# Altium project pca10201.PrjPCB (part 1 of 4)
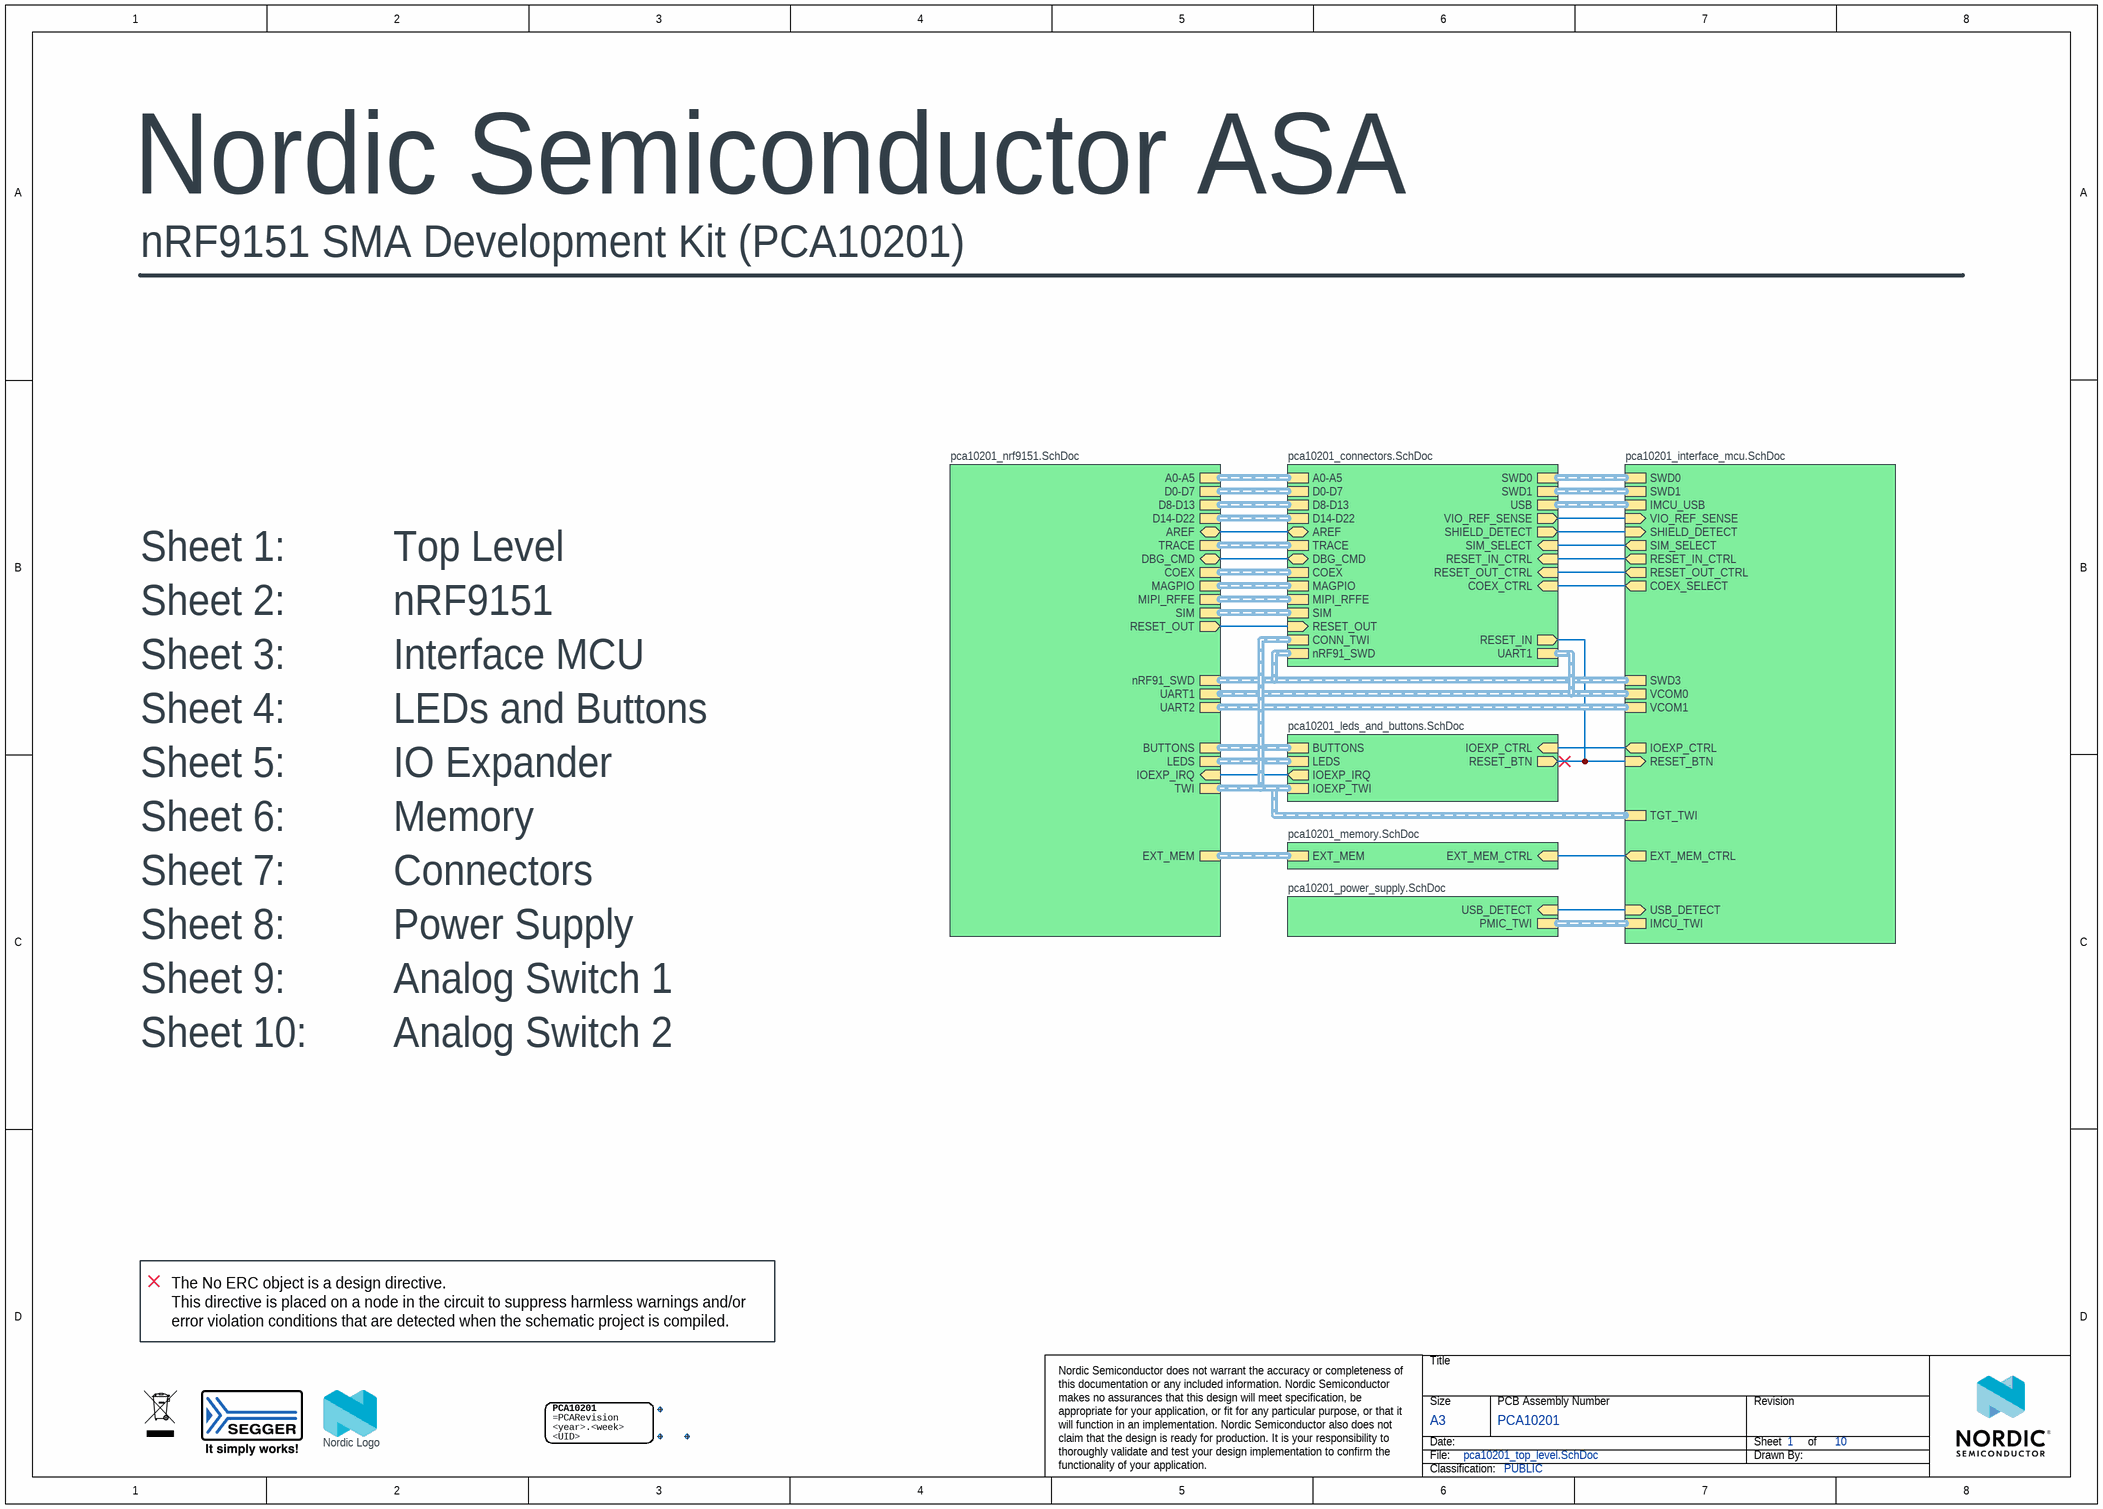
[diagram p0: pca10201_top_level.SchDoc]
SurfaceFinish: ENIG Gold; SoldermaskColor: Blue; SilkscreenColor: White; ProjectName: nRF9151-DK; ProductName: nRF9151-SMA-DK; PCBStackup: 4001; PCBRevision: 0478RUBR; PCBNumber: 400926; PCARevision: 1.0.0; PCAName: PCA10201; Organization: Nordic Semiconductor; NrOfLayers: 4; Dielectric: FR-4; Designer: RUBR; Compliance: RoHS, REACH, Halogen-Free; Classification: PUBLIC; BoardTitle: nRF9151 SMA Development Kit; BoardThickness: 1.6mm
10 sheets, 311 parts. Net scope: hierarchical (ports join the sheet entries above them; power ports are global).
Board file: 400926.PcbDoc
Sheets:
  pca10201_top_level.SchDoc
     = pca10201_nrf9151.SchDoc
     = pca10201_interface_mcu.SchDoc
      S1 = pca10201_switch_fsa.SchDoc
      S2 = pca10201_switch_fsa.SchDoc
      S3 = pca10201_switch_fsa.SchDoc
      S4 = pca10201_switch_fsa.SchDoc
     = pca10201_leds_and_buttons.SchDoc
      S5 = pca10201_switch_fsa.SchDoc
      S6 = pca10201_switch_fsa.SchDoc
      S7 = pca10201_switch_nx.SchDoc
      Designator = pca10201_io_expander.SchDoc
     = pca10201_memory.SchDoc
      S8 = pca10201_switch_fsa.SchDoc
     = pca10201_connectors.SchDoc
      S9 = pca10201_switch_nx.SchDoc
      S10 = pca10201_switch_fsa.SchDoc
      S11 = pca10201_switch_fsa.SchDoc
     = pca10201_power_supply.SchDoc

## Sheet pca10201_top_level.SchDoc: =BoardTitle + ' - Top Level'
size A3; Organization: Nordic Semiconductor; DocumentNumber: 1; Revision: 1.0.0; SheetNumber: 1; SheetTotal: 10; Author: RUBR; CompanyName: Nordic Semiconductor; DrawnBy: RUBR; DocumentSize: A3; ProjectName: nRF9151-DK

### Parts
Fid1  Fiducial mark  [Fiducial]  (value not drawn)
Fid2  Fiducial mark  [Fiducial]  (value not drawn)
Fid3  Fiducial mark  [Fiducial]  (value not drawn)
LABEL1  15x40mm  [LabelSilk_15x40]  (value not drawn)
LOGO1  WEE Symbol  [WEEE_3x4.5mm]  (value not drawn)  (no BOM)
LOGO2  Segger Logo S  [SEGGER_LOGO_S]  (value not drawn)  (no BOM)
LOGO3  Nordic Logo  [NORDIC_LOGO_LYING]  (no BOM)

### Sub-sheets
? = pca10201_nrf9151.SchDoc: nRF91_SWD (harness SWD), DBG_CMD (bidir), UART1 (harness UART), COEX (harness COEX), UART2 (harness UART), SIM (harness SIM), TWI (harness TWI), A0-A5 (harness 6CH), AREF (bidir), TRACE (harness TRACE), BUTTONS (harness 4CH), LEDS (harness 4CH), IOEXP_IRQ (in), EXT_MEM (harness SPI), MIPI_RFFE (harness MIPI_RFFE), MAGPIO (harness MAGPIO), RESET_OUT (out), D8-D13 (harness 6CH), D14-D22 (harness 9CH), D0-D7 (harness 8CH)
? = pca10201_interface_mcu.SchDoc: VCOM1 (harness UART), VCOM0 (harness UART), USB_DETECT (in), RESET_BTN (in), SWD3 (harness SWD), SWD1 (harness SWD), IMCU_USB (harness USB), SWD0 (harness SWD), COEX_SELECT (out), IOEXP_CTRL (out), SIM_SELECT (out), TGT_TWI (harness TWI), VIO_REF_SENSE (in), IMCU_TWI (harness TWI), RESET_IN_CTRL (out), EXT_MEM_CTRL (out), SHIELD_DETECT (in), RESET_OUT_CTRL (out)
? = pca10201_leds_and_buttons.SchDoc: BUTTONS (harness 4CH), LEDS (harness 4CH), IOEXP_CTRL (in), IOEXP_IRQ (out), RESET_BTN (out), IOEXP_TWI (harness TWI)
? = pca10201_memory.SchDoc: EXT_MEM_CTRL (in), EXT_MEM (harness SPI)
? = pca10201_connectors.SchDoc: COEX (harness COEX), nRF91_SWD (harness SWD), DBG_CMD (bidir), MIPI_RFFE (harness MIPI_RFFE), A0-A5 (harness 6CH), TRACE (harness TRACE), USB (harness USB), SIM (harness SIM), AREF (bidir), MAGPIO (harness MAGPIO), SWD0 (harness SWD), SWD1 (harness SWD), SHIELD_DETECT (out), UART1 (harness UART), SIM_SELECT (in), VIO_REF_SENSE (out), CONN_TWI (harness TWI), RESET_IN_CTRL (in), RESET_OUT (in), RESET_OUT_CTRL (in), RESET_IN (out), D8-D13 (harness 6CH), D14-D22 (harness 9CH), D0-D7 (harness 8CH), COEX_CTRL (in)
? = pca10201_power_supply.SchDoc: USB_DETECT (in), PMIC_TWI (harness TWI)

### Nets
COEX_SELECT: sheet /COEX_SELECT, sheet /COEX_CTRL
DBG_CMD: sheet /DBG_CMD, sheet /DBG_CMD
EXT_MEM_CTRL: sheet /EXT_MEM_CTRL, sheet /EXT_MEM_CTRL
IOEXP_CTRL: sheet /IOEXP_CTRL, sheet /IOEXP_CTRL
P0.19/AIN6: sheet /IOEXP_IRQ, sheet /IOEXP_IRQ
P0.20/AIN7: sheet /AREF, sheet /AREF
P0.21: sheet /RESET_OUT, sheet /RESET_OUT
RESET_BUTTON: sheet /RESET_BTN, sheet /RESET_BTN, sheet /RESET_IN
RESET_IN_CTRL: sheet /RESET_IN_CTRL, sheet /RESET_IN_CTRL
RESET_OUT_CTRL: sheet /RESET_OUT_CTRL, sheet /RESET_OUT_CTRL
SHIELD_DETECT: sheet /SHIELD_DETECT, sheet /SHIELD_DETECT
SIM_SELECT: sheet /SIM_SELECT, sheet /SIM_SELECT
USB_DETECT: sheet /USB_DETECT, sheet /USB_DETECT
VIO_REF_SENSE: sheet /VIO_REF_SENSE, sheet /VIO_REF_SENSE

### Buses and harness runs
harness sheet /CONN_TWI = sheet /IOEXP_TWI = sheet /TGT_TWI = sheet /TWI
harness sheet /IMCU_TWI = sheet /PMIC_TWI
harness sheet /IMCU_USB = sheet /USB
harness sheet /nRF91_SWD = sheet /SWD3
harness sheet /UART1 = sheet /VCOM0
harness sheet /UART2 = sheet /VCOM1

### Notes on the sheet
- Sheet 1:          Top Level
- Sheet 2:          nRF9151
- Sheet 3:          Interface MCU
- Sheet 4:          LEDs and Buttons
- Sheet 5:          IO Expander
- Sheet 6:          Memory
- Sheet 7:          Connectors
- Sheet 8:          Power Supply
- Sheet 9:          Analog Switch 1
- Sheet 10:        Analog Switch 2
- The No ERC object is a design directive.
  This directive is placed on a node in the circuit to suppress harmless warnings and/or error violation conditions that are detected when the schematic project is compiled.
- Nordic Semiconductor ASA
- Title
- Size
- Date:
- File:
- A3
- PCB Assembly Number
- Sheet
- Drawn By:
- Revision
- of
- Nordic Semiconductor does not warrant the accuracy or completeness of this documentation or any included information. Nordic Semiconductor makes no assurances that this design will meet specification, be appropriate for your application, or fit for any particular purpose, or that it will function in an implementation. Nordic Semiconductor also does not claim that the design is ready for production. It is your responsibility to thoroughly validate and test your design implementation to confirm the functionality of your application.
  © Nordic Semiconductor — All rights reserved.
- Classification:
- (in symbol Label_15x40) <year>.<week>; <UID>

### Library data of the parts
Fid1-Fid3 = Fid-Mark: Manufacturer: N.A.; Part number NEMS: 100500073; Value: N.A.; Assembly: Not mounted; Pad Count: 1; Component Status: Active; System: Connector; Part Number: Fid-Mark; Manufacturer Part Number: N.A.; LatestRevisionDate: 2009-12-12; Published: 2009-12-12; Note: N.A.; Artikkelnr Noca: N.A.; Footprint Doc: Fiducial; Part number IPS: N.A.; ComponentLink1URL: N.A.; ComponentLink1Description: Datasheet; ComponentLink2URL: N.A.; ComponentLink2Description: Supplier link; HelpURL: N.A.; Supplier 1: N.A.; Supplier Part Number 1: N.A.; Supplier 2: N.A.; Supplier Part Number 2: N.A.; PartId: 100500073; Component Class: Connectors; Author: rsk; Part number Norautron: N.A.
LABEL1 = Label_15x40: PCA version label, stick-on, 15x40mm; Manufacturer: Ellco Etikett; Manufacturer Part Number: 51945; Part number NEMS: 101200030; Component Status: Active; Pad Count: 0; Note: N.A.; Assembly: See section for "Marking/ Stick-on label specification; Part Number: Label_15x40; Component Class: Mechanicals; Author: hany; ComponentLink1URL: N.A.; ComponentLink1Description: Datasheet; ComponentLink2URL: N.A.; ComponentLink2Description: Supplier link; HelpURL: N.A.; LatestRevisionDate: 2023-01-05; Published: 2023-01-05; Footprint Doc: Label; Value: 15x40mm; Supplier 1: N.A.; Supplier Part Number 1: N.A.; Supplier 2: N.A.; Supplier Part Number 2: N.A.; Artikkelnr Noca: N.A.; Part number IPS: N.A.; Part number Norautron: N.A.; PartId: 101200030
LOGO1 = WEEE Symbol 3x4.5mm: WEEE Directive symbol; Manufacturer: N.A.; Part number NEMS: 101100006; Component Status: Active; Pad Count: 0; Part Number: WEEE Symbol 3x4.5mm; PartId: 101100006; Component Class: Markings; Author: rsk; Manufacturer Part Number: N.A.; ComponentLink1URL: N.A.; ComponentLink1Description: Datasheet; ComponentLink2URL: N.A.; ComponentLink2Description: Supplier link; HelpURL: N.A.; LatestRevisionDate: 2023-03-07; Published: 2016-09-07; Footprint Doc: WEEE_3x4.5mm; Value: WEE Symbol; Note: N.A.; Supplier 1: N.A.; Supplier Part Number 1: N.A.; Supplier 2: N.A.; Supplier Part Number 2: N.A.; Artikkelnr Noca: N.A.; Part number IPS: N.A.; Part number Norautron: N.A.
LOGO2 = Segger Logo S: Segger logo, small size; Manufacturer: N.A.; Part number NEMS: 101100004; Component Status: Active; Pad Count: 0; Part Number: Segger Logo S; PartId: 101100004; Component Class: Markings; Author: rsk; Manufacturer Part Number: N.A.; ComponentLink1URL: N.A.; ComponentLink1Description: Datasheet; ComponentLink2URL: N.A.; ComponentLink2Description: Supplier link; HelpURL: N.A.; LatestRevisionDate: 2016-09-07; Published: 2016-09-07; Footprint Doc: Segger Logo S; Value: Segger Logo S; Note: N.A.; Supplier 1: N.A.; Supplier Part Number 1: N.A.; Supplier 2: N.A.; Supplier Part Number 2: N.A.; Artikkelnr Noca: N.A.; Part number IPS: N.A.; Part number Norautron: N.A.
LOGO3 = Nordic Logo lying: Manufacturer: N.A.; Part number NEMS: 101100001; Component Status: Active; Pad Count: 0; Part Number: Nordic Logo lying; PartId: 101100001; Component Class: Markings; Author: rsk; Manufacturer Part Number: N.A.; ComponentLink1URL: N.A.; ComponentLink1Description: Datasheet; ComponentLink2URL: N.A.; ComponentLink2Description: Supplier link; HelpURL: N.A.; LatestRevisionDate: 2017-03-20; Published: 2017-09-01; Footprint Doc: Nordic Logo; Value: Nordic Logo; Note: N.A.; Supplier 1: N.A.; Supplier Part Number 1: N.A.; Supplier 2: N.A.; Supplier Part Number 2: N.A.; Artikkelnr Noca: N.A.; Part number IPS: N.A.; Part number Norautron: N.A.

## Sheet pca10201_nrf9151.SchDoc: =BoardTitle + ' - nRF9151'
size A3; Organization: Nordic Semiconductor; DocumentNumber: 2; Revision: 1.0.0; SheetNumber: 2; SheetTotal: 10; Author: RUBR; CompanyName: Nordic Semiconductor; DrawnBy: RUBR; DocumentSize: A3; ProjectName: nRF9151-DK
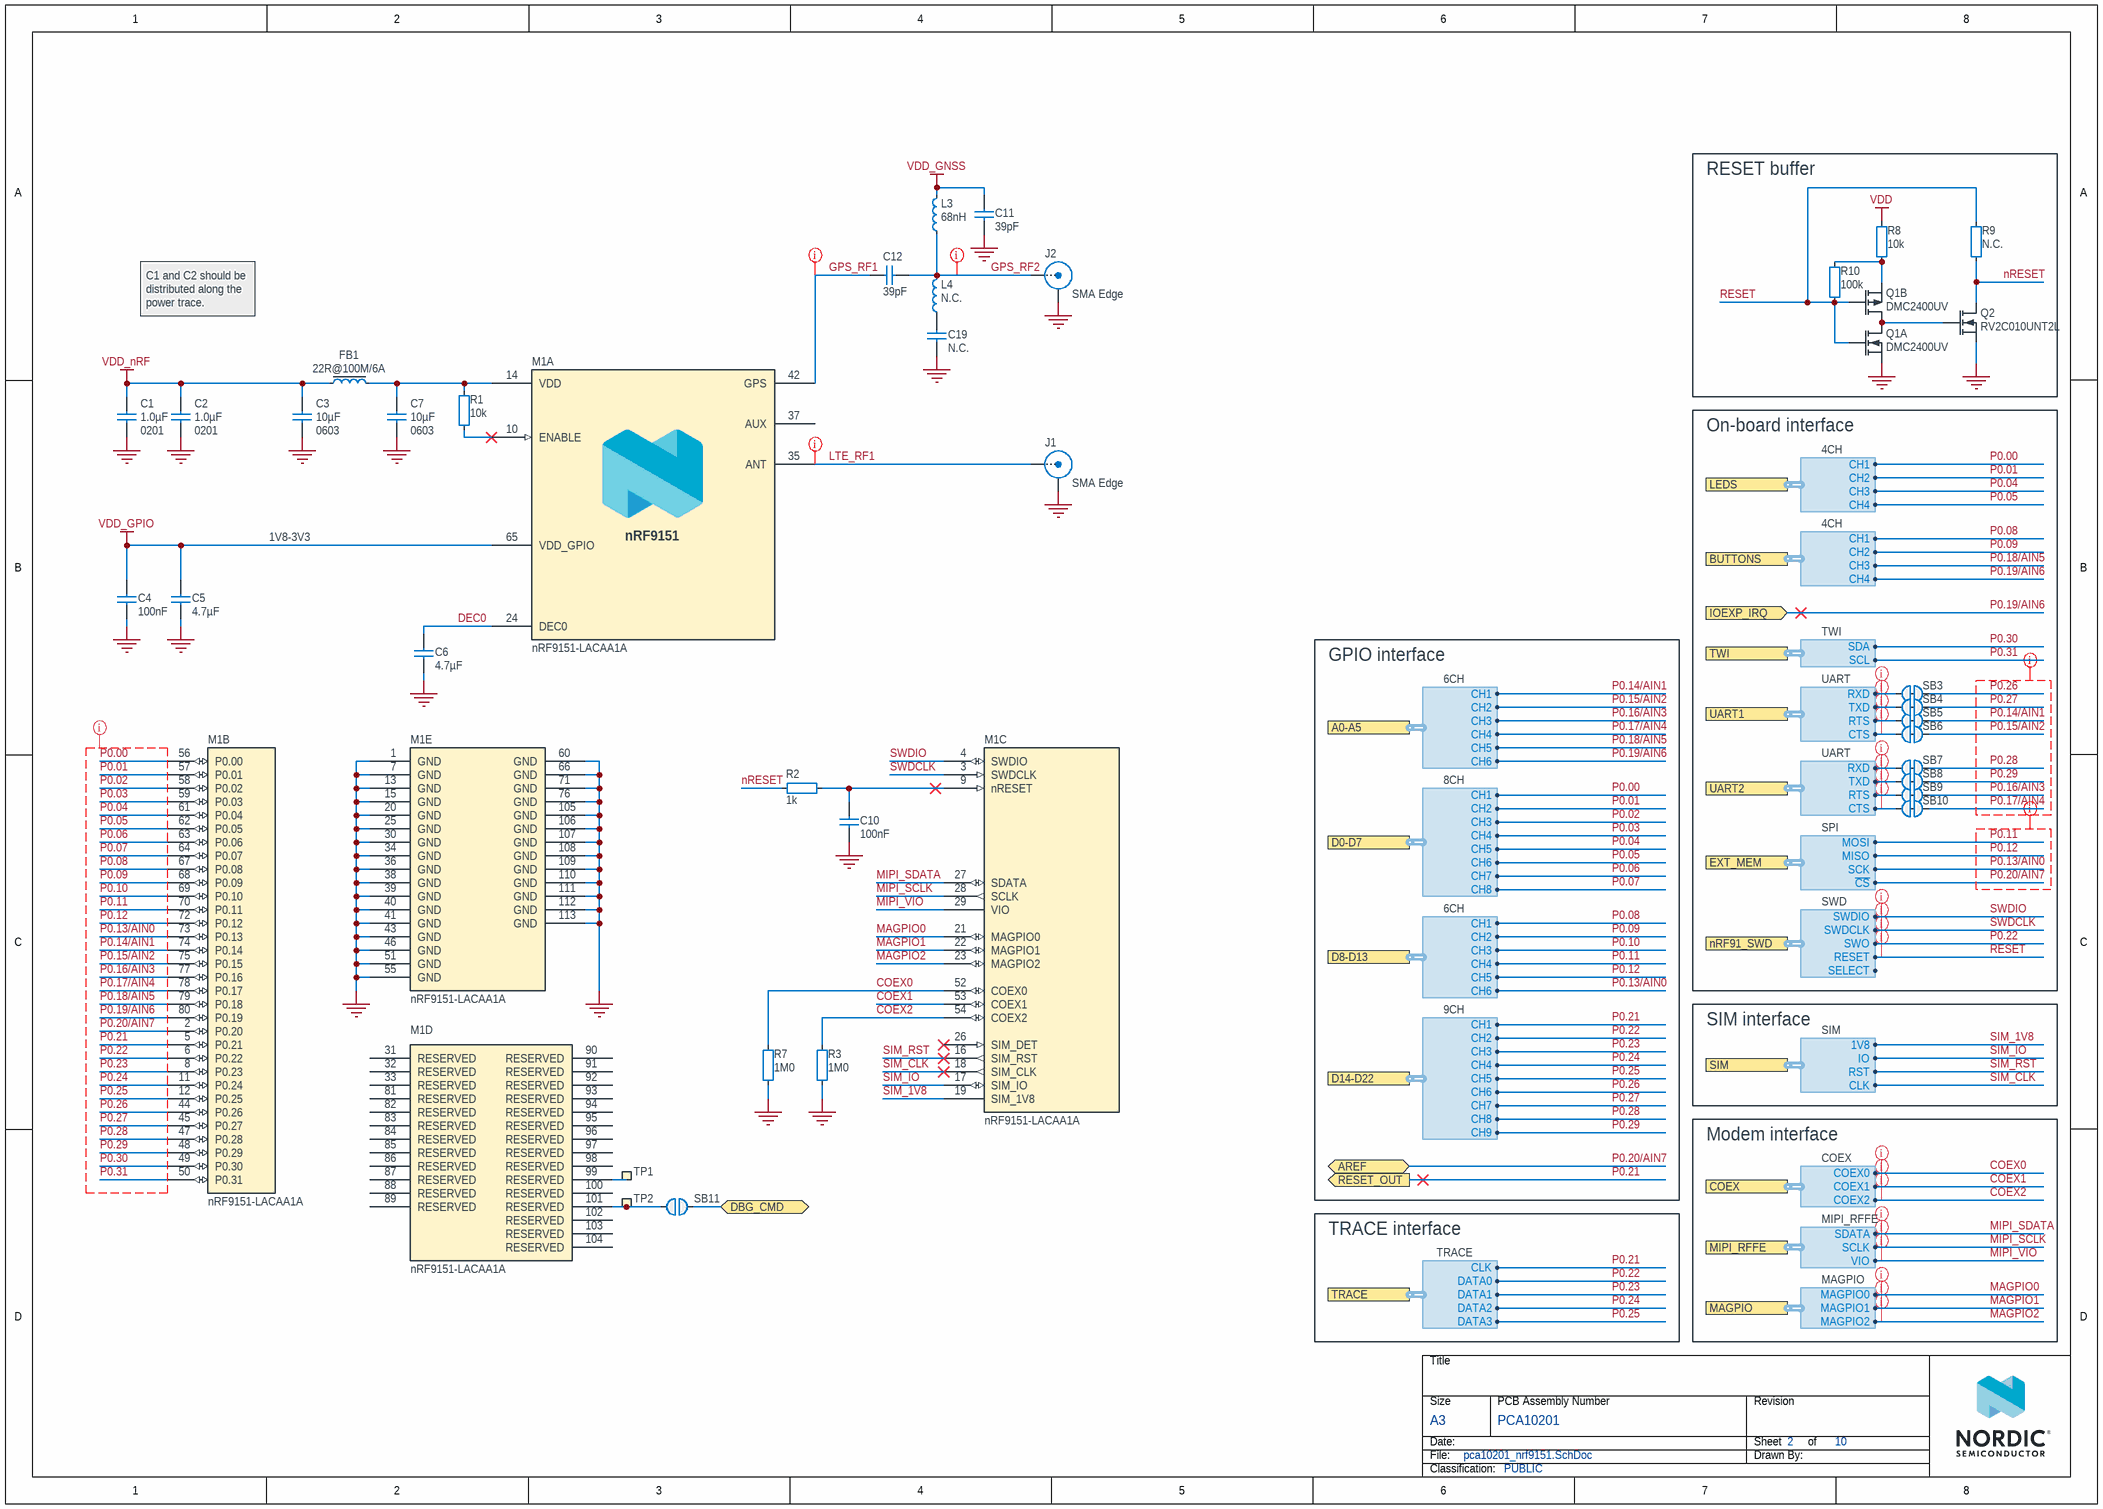
[diagram p1: pca10201_nrf9151.SchDoc]

### Parts
C1  1.0µF  Footprint Doc: 0201  [CAPC0603X03L_C]
C2  1.0µF  Footprint Doc: 0201  [CAPC0603X03L_C]
C3  10µF  Footprint Doc: 0603  [CAPC1608X06L]
C4  100nF  [CAPC0603X03L_C]
C5  4.7µF  [CAPC1005X04L]
C6  4.7µF  [CAPC1005X04L]
C7  10µF  Footprint Doc: 0603  [CAPC1608X06L]
C10  100nF  [CAPC0603X03L_C]
C11  39pF  [CAPC0603X03L_C]
C12  39pF  [CAPC0603X03L_C]
C19  N.C.  [CAPC0603X03L_C_NC]
FB1  22R@100M/6A  [INDC1608X06L]
J1  SMA Edge  [CONSMA024-G]
J2  SMA Edge  [CONSMA024-G]
L3  68nH  [INDC1005X04L_WW]
L4  N.C.  [INDC1005X04L_NC]
M1  nRF9151-LACAA1A  [LGA50P1210X1110X130-113N]  (parts A,B,C,D,E of 5)
Q1  DMC2400UV  [SOTFL50P162X60-6N]  (parts A,B of 2)
Q2  RV2C010UNT2L  [DFN65P100X40-3L]
R1  10k  [RESC0603X03L_C]
R2  1k  [RESC0603X03L_C]
R3  1M0  [RESC0603X03L_C]
R7  1M0  [RESC0603X03L_C]
R8  10k  [RESC0603X03L_C]
R9  N.C.  [RESC0603X03L_C_NC]
R10  100k  [RESC0603X03L_C]
SB3  Solderbridge  [Solderbridge_Shorted]  (value not drawn)  (net tie, no BOM)
SB4  Solderbridge  [Solderbridge_Shorted]  (value not drawn)  (net tie, no BOM)
SB5  Solderbridge  [Solderbridge_Shorted]  (value not drawn)  (net tie, no BOM)
SB6  Solderbridge  [Solderbridge_Shorted]  (value not drawn)  (net tie, no BOM)
SB7  Solderbridge  [Solderbridge_Shorted]  (value not drawn)  (net tie, no BOM)
SB8  Solderbridge  [Solderbridge_Shorted]  (value not drawn)  (net tie, no BOM)
SB9  Solderbridge  [Solderbridge_Shorted]  (value not drawn)  (net tie, no BOM)
SB10  Solderbridge  [Solderbridge_Shorted]  (value not drawn)  (net tie, no BOM)
SB11  Solderbridge  [Solderbridge]  (value not drawn)  (no BOM)
TP1  Ø1.0mm,SMD  [TP_SMD_D1.0mm]  (value not drawn)  (no BOM)
TP2  Ø1.0mm,SMD  [TP_SMD_D1.0mm]  (value not drawn)  (no BOM)

### Blocks framed on the sheet
RESET buffer: Q1 Q2 R8-R10
On-board interface: SB3-SB10

### Ports
A0-A5 (harness 6CH), AREF (bidir), BUTTONS (harness 4CH), COEX (harness COEX), D0-D7 (harness 8CH), D8-D13 (harness 6CH), D14-D22 (harness 9CH), DBG_CMD (bidir), EXT_MEM (harness SPI), IOEXP_IRQ (in), LEDS (harness 4CH), MAGPIO (harness MAGPIO), MIPI_RFFE (harness MIPI_RFFE), nRF91_SWD (harness SWD), RESET_OUT (out), SIM (harness SIM), TRACE (harness TRACE), TWI (harness TWI), UART1 (harness UART), UART2 (harness UART)

### Harnesses
COEX: COEX0, COEX2, COEX1
UART: RTS, CTS, RXD, TXD
SIM: CLK, IO, 1V8, RST
SWD: SWDIO, SWDCLK, SWO, RESET, SELECT
TWI: SCL, SDA
TRACE: CLK, DATA0, DATA1, DATA3, DATA2
SPI: SCK, ~{CS}, MOSI, MISO
MIPI_RFFE: SDATA, VIO, SCLK
MAGPIO: MAGPIO0, MAGPIO2, MAGPIO1
4CH: CH1, CH2, CH3, CH4
6CH: CH1, CH2, CH3, CH4, CH5, CH6
8CH: CH1, CH2, CH3, CH4, CH5, CH6, CH7, CH8
9CH: CH1, CH2, CH3, CH4, CH5, CH6, CH7, CH8, CH9

### Nets
GND: C1.2 C2.2 C3.2 C4.2 C5.2 C6.2 C7.2 C10.2 C11.1 C19.1 J1.2(Y) J2.2(Y) M1.1(GND) M1.7(GND) M1.13(GND) M1.15(GND) M1.20(GND) M1.25(GND) M1.30(GND) M1.34(GND) M1.36(GND) M1.38(GND) M1.39(GND) M1.40(GND) M1.41(GND) M1.43(GND) M1.46(GND) M1.51(GND) M1.55(GND) M1.60(GND) M1.66(GND) M1.71(GND) M1.76(GND) M1.105(GND) M1.106(GND) M1.107(GND) M1.108(GND) M1.109(GND) M1.110(GND) M1.111(GND) M1.112(GND) M1.113(GND) Q1.1(S1) Q2.2(S) R3.1 R7.1
VDD: R8.1
VDD_GNSS: C11.2 L3.1
VDD_GPIO: C4.1 C5.1 M1.65(VDD_GPIO)
VDD_nRF: C1.1 C2.1 C3.1 FB1.1
COEX0: M1.52(COEX0) R7.2 ; port COEX.COEX0
COEX1: M1.53(COEX1) ; port COEX.COEX1
COEX2: M1.54(COEX2) R3.2 ; port COEX.COEX2
DBG_CMD: SB11.1 ; port DBG_CMD
DEC0: C6.1 M1.24(DEC0)
GPS_RF1: C12.2 M1.42(GPS)
GPS_RF2: C12.1 J2.1(X) L3.2 L4.1
LTE_RF1: J1.1(X) M1.35(ANT)
MAGPIO0: M1.21(MAGPIO0) ; port MAGPIO.MAGPIO0
MAGPIO1: M1.22(MAGPIO1) ; port MAGPIO.MAGPIO1
MAGPIO2: M1.23(MAGPIO2) ; port MAGPIO.MAGPIO2
MIPI_SCLK: M1.28(SCLK) ; port MIPI_RFFE.SCLK
MIPI_SDATA: M1.27(SDATA) ; port MIPI_RFFE.SDATA
MIPI_VIO: M1.29(VIO) ; port MIPI_RFFE.VIO
nRESET: Q2.3(D) R2.1 R9.2
P0.00: M1.56(P0.00) ; port LEDS.CH1, port D0-D7.CH1
P0.01: M1.57(P0.01) ; port LEDS.CH2, port D0-D7.CH2
P0.02: M1.58(P0.02) ; port D0-D7.CH3
P0.03: M1.59(P0.03) ; port D0-D7.CH4
P0.04: M1.61(P0.04) ; port LEDS.CH3, port D0-D7.CH5
P0.05: M1.62(P0.05) ; port LEDS.CH4, port D0-D7.CH6
P0.06: M1.63(P0.06) ; port D0-D7.CH7
P0.07: M1.64(P0.07) ; port D0-D7.CH8
P0.08: M1.67(P0.08) ; port BUTTONS.CH1, port D8-D13.CH1
P0.09: M1.68(P0.09) ; port BUTTONS.CH2, port D8-D13.CH2
P0.10: M1.69(P0.10) ; port D8-D13.CH3
P0.11: M1.70(P0.11) ; port EXT_MEM.MOSI, port D8-D13.CH4
P0.12: M1.72(P0.12) ; port EXT_MEM.MISO, port D8-D13.CH5
P0.13/AIN0: M1.73(P0.13) ; port EXT_MEM.SCK, port D8-D13.CH6
P0.14/AIN1: M1.74(P0.14) SB5.1 ; port A0-A5.CH1
P0.15/AIN2: M1.75(P0.15) SB6.1 ; port A0-A5.CH2
P0.16/AIN3: M1.77(P0.16) SB9.1 ; port A0-A5.CH3
P0.17/AIN4: M1.78(P0.17) SB10.1 ; port A0-A5.CH4
P0.18/AIN5: M1.79(P0.18) ; port BUTTONS.CH3, port A0-A5.CH5
P0.19/AIN6: M1.80(P0.19) ; port IOEXP_IRQ, port BUTTONS.CH4, port A0-A5.CH6
P0.20/AIN7: M1.2(P0.20) ; port AREF, port EXT_MEM.~{CS}
P0.21: M1.5(P0.21) ; port RESET_OUT, port TRACE.CLK, port D14-D22.CH1
P0.22: M1.6(P0.22) ; port nRF91_SWD.SWO, port TRACE.DATA0, port D14-D22.CH2
P0.23: M1.8(P0.23) ; port TRACE.DATA1, port D14-D22.CH3
P0.24: M1.11(P0.24) ; port TRACE.DATA2, port D14-D22.CH4
P0.25: M1.12(P0.25) ; port TRACE.DATA3, port D14-D22.CH5
P0.26: M1.44(P0.26) SB3.1 ; port D14-D22.CH6
P0.27: M1.45(P0.27) SB4.1 ; port D14-D22.CH7
P0.28: M1.47(P0.28) SB7.1 ; port D14-D22.CH8
P0.29: M1.48(P0.29) SB8.1 ; port D14-D22.CH9
P0.30: M1.49(P0.30) ; port TWI.SDA
P0.31: M1.50(P0.31) ; port TWI.SCL
RESET: Q1.2(G1) Q1.5(G2) R9.1 R10.1 ; port nRF91_SWD.RESET
SIM_1V8: M1.19(SIM_1V8) ; port SIM.1V8
SIM_CLK: M1.18(SIM_CLK) ; port SIM.CLK
SIM_IO: M1.17(SIM_IO) ; port SIM.IO
SIM_RST: M1.16(SIM_RST) ; port SIM.RST
SWDCLK: M1.3(SWDCLK) ; port nRF91_SWD.SWDCLK
SWDIO: M1.4(SWDIO) ; port nRF91_SWD.SWDIO
NetC7_1: C7.1 FB1.2 M1.14(VDD) R1.1
NetC10_1: C10.1 M1.9(nRESET) R2.2
NetC19_2: C19.2 L4.2
NetM1_10: M1.10(ENABLE) R1.2
NetM1_99: M1.99(RESERVED) TP1.1
NetM1_101: M1.101(RESERVED) SB11.2 TP2.1
NetP29_2: SB5.2 ; port UART1.RTS
NetP29_4: SB3.2 ; port UART1.RXD
NetP29_5: SB4.2 ; port UART1.TXD
NetP29_6: SB6.2 ; port UART1.CTS
NetQ1_3: Q1.3(D2) Q1.6(D1) Q2.1(G)
NetQ1_4: Q1.4(S2) R8.2 R10.2
NetSB7_2: SB7.2 ; port UART2.RXD
NetSB8_2: SB8.2 ; port UART2.TXD
NetSB9_2: SB9.2 ; port UART2.RTS
NetSB10_2: SB10.2 ; port UART2.CTS

Not connected (* = marked no-connect by the designer): M1 26(SIM_DET)* 31(RESERVED) 32(RESERVED) 33(RESERVED) 37(AUX) 81(RESERVED) 82(RESERVED) 83(RESERVED) 84(RESERVED) 85(RESERVED) 86(RESERVED) 87(RESERVED) 88(RESERVED) 89(RESERVED) 90(RESERVED) 91(RESERVED) 92(RESERVED) 93(RESERVED) 94(RESERVED) 95(RESERVED) 96(RESERVED) 97(RESERVED) 98(RESERVED) 100(RESERVED) 102(RESERVED) 103(RESERVED) 104(RESERVED)

### Layout directives
net class SWD: P0.22, RESET, SWDCLK, SWDIO
net class COEX: COEX0, COEX1, COEX2, MAGPIO0, MAGPIO1, MAGPIO2, MIPI_SCLK, MIPI_SDATA, MIPI_VIO
net class GPIO: NetP29_2, NetP29_4, NetP29_5, NetP29_6, NetSB7_2, NetSB8_2, NetSB9_2, NetSB10_2, P0.00, P0.01, P0.02, P0.03, P0.04, P0.05, P0.06, P0.07, P0.08, P0.09, P0.10, P0.11, P0.12, P0.13/AIN0, P0.14/AIN1, P0.15/AIN2, P0.16/AIN3, P0.17/AIN4, P0.18/AIN5, P0.19/AIN6, P0.20/AIN7, P0.21, P0.22, P0.23, P0.24, P0.25, P0.26, P0.27, P0.28, P0.29, P0.30, P0.31
net class RF: GPS_RF1, GPS_RF2, LTE_RF1
net class nRF9151_UART: P0.14/AIN1, P0.15/AIN2, P0.16/AIN3, P0.17/AIN4, P0.26, P0.27, P0.28, P0.29
net class EXT_MEM: P0.11, P0.12, P0.13/AIN0, P0.20/AIN7

### Notes on the sheet
- C1 and C2 should be distributed along the power trace.
- 1V8-3V3
- GPIO interface
- SIM interface
- Modem interface
- TRACE interface
- Title
- Size
- Date:
- File:
- A3
- PCB Assembly Number
- Sheet
- Drawn By:
- Revision
- of
- Classification:

### Library data of the parts
C1 C2 = C0201-1µ0-10V-X5R-GRM033R61A105ME15: Capacitor, X5R, ±20%, 10V; Manufacturer: Murata; Part number NEMS: 100200545; Artikkelnr Noca: N.A.; Pad Count: 2; Component Status: Active; Part Number: C0201-1µ0-10V-X5R-GRM033R61A105ME15; Manufacturer Part Number: GRM033R61A105ME15; ComponentLink1URL: https://search.murata.co.jp/Ceramy/image/img/A01X/G101/ENG/GRM033R61A105ME15-01.pdf; ComponentLink1Description: Datasheet; ComponentLink2URL: N.A.; ComponentLink2Description: Supplier link; HelpURL: https://www.murata.com/en-us/products/productdetail?partno=GRM033R61A105ME15%23; LatestRevisionDate: 2023-03-22; Published: 2023-03-22; Value: 1.0µF; Note: 10V; Part number IPS: N.A.; Supplier 1: Digi-Key; Supplier Part Number 1: 490-13226-1-ND; Supplier 2: N.A.; Supplier Part Number 2: N.A.; PartId: 100200545; Component Class: Capacitors; Author: rubr; Part number Norautron: N.A.
C3 C7 = C0603-10µ-10V-X6S-GRM188C81A106MA73: Capacitor, Ceramic, 10µF 10V X6S 0603,±20%; Manufacturer: Murata; Part number NEMS: 100200520; Component Status: Active; Pad Count: 2; Artikkelnr Noca: N.A.; Part Number: C0603-10µ-10V-X6S-GRM188C81A106MA73; PartId: 100200520; Component Class: Capacitors; Author: prbu; Manufacturer Part Number: GRM188C81A106MA73; ComponentLink1URL: https://www.murata.com/en-sg/products/productdetail?partno=GRM188C81A106MA73%23; ComponentLink1Description: Datasheet; ComponentLink2URL: https://www.digikey.com/en/products/detail/murata-electronics/GRM188C81A106MA73D/3900461; ComponentLink2Description: Supplier link; HelpURL: N.A.; LatestRevisionDate: 2022-07-01; Published: 2022-07-01; Value: 10µF; Note: 10V; Supplier 1: Digi-Key; Supplier Part Number 1: 490-7197-2-ND; Supplier 2: Mouser; Supplier Part Number 2: 81-GRM188C81A106MA3D; Part number IPS: N.A.; Part number Norautron: N.A.
C4 C10 = C0201-100n: Capacitor, X5R, ±10%, 100nF, 16V; Manufacturer: N.A.; Part number IPS: 00000001248, 00000002505; Part number Norautron: 262071862; Part number NEMS: 100200078; Pad Count: 2; Component Status: Active; Part Number: C0201-100n; Manufacturer Part Number: N.A.; ComponentLink1URL: N.A.; ComponentLink1Description: Datasheet; ComponentLink2URL: N.A.; ComponentLink2Description: Supplier link; HelpURL: N.A.; Footprint Doc: 0201; LatestRevisionDate: 2024-06-27; Published: 2014-11-13; Value: 100nF; Note: 16V; Artikkelnr Noca: N.A.; Supplier 1: N.A.; Supplier Part Number 1: N.A.; Supplier 2: N.A.; Supplier Part Number 2: N.A.; PartId: 100200078; Component Class: Capacitors; Author: rsk
C5 C6 = C0402-4µ7-10V-X5R: Capacitor, X5R, 10V; Manufacturer: Murata; Manufacturer Part Number: GRM155R61A475MEAAD; Part number NEMS: 100200415; Artikkelnr Noca: N.A.; Pad Count: 2; Component Status: Active; Part Number: C0402-4µ7-10V-X5R; ComponentLink1URL: http://search.murata.co.jp/Ceramy/image/img/A01X/G101/ENG/GRM155R61A475MEAA-01.pdf; ComponentLink1Description: Datasheet; ComponentLink2URL: https://www.digikey.com/product-detail/en/murata-electronics-north-america/GRM155R61A475MEAAD/490-14306-1-ND/6234742; ComponentLink2Description: Supplier link; HelpURL: https://psearch.en.murata.com/capacitor/product/GRM155R61A475MEAA%23.html; Footprint Doc: 0402; LatestRevisionDate: 2020-10-13; Published: 2018-10-04; Value: 4.7µF; Note: 10V; Part number IPS: N.A.; Supplier 1: Digi-Key; Supplier Part Number 1: 490-14306-1-ND; Supplier 2: N.A.; Supplier Part Number 2: N.A.; PartId: 100200415; Component Class: Capacitors; Author: rsk; Part number Norautron: N.A.
C11 C12 = C0201-39p: Capacitor, NP0, ±1%, 25V; Manufacturer: Murata; Manufacturer Part Number: GRM0335C1E390FA01D; Part number IPS: 00000001668; Part number NEMS: 100200039; Artikkelnr Noca: N.A.; Pad Count: 2; Component Status: Active; Part Number: C0201-39p; ComponentLink1URL: N.A.; ComponentLink1Description: Datasheet; ComponentLink2URL: N.A.; ComponentLink2Description: Supplier link; HelpURL: N.A.; Footprint Doc: 0201; LatestRevisionDate: 2019-04-16; Published: 2019-04-16; Value: 39pF; Note: 25V; Supplier 1: N.A.; Supplier Part Number 1: N.A.; Supplier 2: N.A.; Supplier Part Number 2: N.A.; PartId: 100200039; Component Class: Capacitors; Author: rsk; Part number Norautron: N.A.
C19 = C0201-N.C.: Not mounted; Manufacturer: N.A.; Part number NEMS: 100200001; Assembly: Not mounted; Note: Chip Cap; Pad Count: 2; Component Status: Active; Part Number: C0201-N.C.; Manufacturer Part Number: N.A.; ComponentLink1URL: N.A.; ComponentLink1Description: Datasheet; ComponentLink2URL: N.A.; ComponentLink2Description: Supplier link; HelpURL: N.A.; Footprint Doc: 0201; LatestRevisionDate: 2014-11-13; Published: 2014-11-13; Value: N.C.; Supplier 1: N.A.; Supplier Part Number 1: N.A.; Supplier 2: N.A.; Supplier Part Number 2: N.A.; Artikkelnr Noca: N.A.; Part number IPS: N.A.; PartId: 100200001; Component Class: Capacitors; Author: rsk; Part number Norautron: N.A.
FB1 = FB0603-22R@100MHz-6000mA: Ferrite Bead, 22 Ohm @ 100MHz, 6000mA, 8 mOhm Max; Manufacturer: Murata; Manufacturer Part Number: BLM18SD220SN1D; Part number NEMS: 100300492; Component Status: Active; Pad Count: 2; Note: Chip EMIFIL Inductor Type Chip Ferrite Bead; Artikkelnr Noca: N.A.; Part Number: FB0603-22R@100MHz-6000mA; Component Class: Inductors; Author: kod1; ComponentLink1URL: N.A.; ComponentLink1Description: Datasheet; ComponentLink2URL: https://www.murata.com/en-us/products/productdata/8796738650142/ENFA0003.pdf; ComponentLink2Description: Supplier link; HelpURL: http://www.murata.com/en-global/products/productdata/8796733767710/S0580E.pdf; LatestRevisionDate: 2024-01-25; Published: 2024-01-25; Footprint Doc: 0603; Value: 22R@100M/6A; Supplier 1: Digi-Key; Supplier Part Number 1: 490-15633-2-ND; Supplier 2: N.A.; Supplier Part Number 2: N.A.; Part number IPS: N.A.; Part number Norautron: N.A.; PartId: 100300492
J1 J2 = SMA-Edge-C02AJ3F64B-1: SMA Jack, Female, 50 Ohm, Board Edge, Cutout, SMT; Manufacturer: Wellshow Technology; Part number NEMS: 100500896; Component Status: Active; Pad Count: 2; Note: N.A.; System: Connector; Part Number: SMA-Edge-C02AJ3F64B-1; Component Class: Connectors; Author: rubr; Manufacturer Part Number: C02AJ3F64B-1; ComponentLink1URL: \\projectdisks\projects\app9717\Datasheet\connectors\Wellshow\C02AJ3F64B-1.pdf; ComponentLink1Description: Datasheet; ComponentLink2URL: N.A.; ComponentLink2Description: Supplier link; HelpURL: N.A.; LatestRevisionDate: 2025-08-11; Published: 2025-03-17; Footprint Doc: C02AJ3F64B-1; Value: SMA Edge; Supplier 1: Cabcon; Supplier Part Number 1: C02AJ3F64B-1; Supplier 2: N.A.; Supplier Part Number 2: N.A.; Artikkelnr Noca: N.A.; Part number IPS: N.A.; Part number Norautron: N.A.; PartId: 100500896
L3 = L0402-68n-Wirewound-Murata: Inductor, 140mA, ±2%, 1960mΩ, Q=20; Manufacturer: Murata; Manufacturer Part Number: LQW15AN68NG00; Part number IPS: 00000002494; Part number NEMS: 100300389; Note: -55°C ~ 125°C; Artikkelnr Noca: N.A.; Pad Count: 2; Component Status: Active; Part Number: L0402-68n-Wirewound-Murata; ComponentLink1URL: https://search.murata.co.jp/Ceramy/image/img/P02/JELF243A-0050.pdf; ComponentLink1Description: Datasheet; ComponentLink2URL: N.A.; ComponentLink2Description: Supplier link; HelpURL: https://psearch.en.murata.com/inductor/product/LQW15AN68NG00%23.html; Footprint Doc: 0402; LatestRevisionDate: 2019-04-16; Published: 2019-04-16; Value: 68nH; Supplier 1: Digi-Key; Supplier Part Number 1: 490-6837-1-ND; Supplier 2: N.A.; Supplier Part Number 2: N.A.; PartId: 100300389; Component Class: Inductors; Author: rsk; Part number Norautron: N.A.
L4 = L0402-N.C.: Not mounted; Manufacturer: N.A.; Part number NEMS: 100300037; Assembly: Not mounted; Pad Count: 2; Component Status: Active; Part Number: L0402-N.C.; Manufacturer Part Number: N.A.; ComponentLink1URL: N.A.; ComponentLink1Description: Datasheet; ComponentLink2URL: N.A.; ComponentLink2Description: Supplier link; HelpURL: N.A.; Footprint Doc: 0402; LatestRevisionDate: 2016-11-24; Published: 2016-11-24; Value: N.C.; Note: N.A.; Supplier 1: N.A.; Supplier Part Number 1: N.A.; Supplier 2: N.A.; Supplier Part Number 2: N.A.; Artikkelnr Noca: N.A.; Part number IPS: N.A.; PartId: 100300037; Component Class: Inductors; Author: rsk; Part number Norautron: N.A.
M1 = nRF9151-LACAA1A: Low power System-in-Package with integrated LTE-M/NB-IoT modem and GPS; Manufacturer: Nordic Semiconductor; Part number NEMS: 102000407; Component Status: Active; Pad Count: 113; Note: N.A.; Part Number: nRF9151-LACAA1A; Component Class: Nordic_Devices; Author: getr; Manufacturer Part Number: nRF9151-LACAA1A; ComponentLink1URL: N.A.; ComponentLink1Description: Datasheet; ComponentLink2URL: N.A.; ComponentLink2Description: Supplier link; HelpURL: N.A.; LatestRevisionDate: 2025-04-09; Published: 2025-04-09; Footprint Doc: LGA-113; Value: nRF9151-LACAA1A; Supplier 1: Nordic Semiconductor; Supplier Part Number 1: nRF9151-LACAA1A; Supplier 2: N.A.; Supplier Part Number 2: N.A.; Artikkelnr Noca: N.A.; Part number IPS: N.A.; Part number Norautron: N.A.; PartId: 102000407
Q1 = DMC2400UV: Dual N & P Ch MOFET, 1.03A/0.7A, 480mOhm, 450mW; Manufacturer: Diodes Incorporated; Part number IPS: 00000007803; Part number NEMS: 101300117; Note: Dual N & P Channel Digital FET; Artikkelnr Noca: N.A.; Pad Count: 6; Component Status: Active; Part Number: DMC2400UV; Manufacturer Part Number: DMC2400UV; ComponentLink1URL: N.A.; ComponentLink1Description: Datasheet; ComponentLink2URL: N.A.; ComponentLink2Description: Supplier link; HelpURL: http://www.diodes.com/_files/datasheets/DMC2400UV.pdf; Footprint Doc: SOT-563; LatestRevisionDate: 2016-01-18; Published: 2016-01-18; Value: DMC2400UV; Supplier 1: Digi-Key; Supplier Part Number 1: DMC2400UV-7DICT-ND; Supplier 2: N.A.; Supplier Part Number 2: N.A.; PartId: 101300117; Component Class: Semiconductors; Author: rsk; Part number Norautron: N.A.
Q2 = RV2C010UNT2L: N-Channel MOSFET, 20V, 1A, 470mOhm, 400mW, -55°C ~ 150°C; Manufacturer: Rohm Semiconductor; Part number IPS: 00000009976; Part number Norautron: 26320026; Part number NEMS: 101300132; Note: N.A.; Artikkelnr Noca: 35010020; Pad Count: 3; Component Status: Active; Part Number: RV2C010UNT2L; Manufacturer Part Number: RV2C010UNT2L; ComponentLink1URL: N.A.; ComponentLink1Description: Datasheet; ComponentLink2URL: N.A.; ComponentLink2Description: Supplier link; HelpURL: http://rohmfs.rohm.com/en/products/databook/datasheet/discrete/transistor/mosfet/rv2c010unt2l-e.pdf; Footprint Doc: DFN-3; LatestRevisionDate: 2024-09-18; Published: 2016-08-09; Value: RV2C010UNT2L; Supplier 1: Digi-Key; Supplier Part Number 1: RV2C010UNT2LCT-ND; Supplier 2: Mouser; Supplier Part Number 2: 755-RV2C010UNT2L; PartId: 101300132; Component Class: Semiconductors; Author: rsk
R1 R8 = R0201-10k: Resistor, ±1%, 0.05W; Manufacturer: N.A.; Part number IPS: 00000001255; Part number Norautron: 26107101; Part number NEMS: 100100065; Note: Chip Res 1%; Pad Count: 2; Component Status: Active; Part Number: R0201-10k; Manufacturer Part Number: N.A.; ComponentLink1URL: N.A.; ComponentLink1Description: Datasheet; ComponentLink2URL: N.A.; ComponentLink2Description: Supplier link; HelpURL: N.A.; Footprint Doc: 0201; LatestRevisionDate: 2014-11-13; Published: 2014-11-13; Value: 10k; Artikkelnr Noca: N.A.; Supplier 1: N.A.; Supplier Part Number 1: N.A.; Supplier 2: N.A.; Supplier Part Number 2: N.A.; PartId: 100100065; Component Class: Resistors; Author: rsk
R2 = R0201-1k0: Resistor, ±1%, 0.05W; Manufacturer: N.A.; Part number IPS: 00000005786; Part number NEMS: 100100043; Note: Chip Res 1%; Pad Count: 2; Component Status: Active; Part Number: R0201-1k0; Manufacturer Part Number: N.A.; ComponentLink1URL: N.A.; ComponentLink1Description: Datasheet; ComponentLink2URL: N.A.; ComponentLink2Description: Supplier link; HelpURL: N.A.; Footprint Doc: 0201; LatestRevisionDate: 2014-11-13; Published: 2014-11-13; Value: 1k; Artikkelnr Noca: N.A.; Supplier 1: N.A.; Supplier Part Number 1: N.A.; Supplier 2: N.A.; Supplier Part Number 2: N.A.; PartId: 100100043; Component Class: Resistors; Author: rsk; Part number Norautron: N.A.
R3 R7 = R0201-1M0: Resistor, ±1%, 0.05W; Manufacturer: N.A.; Part number IPS: 00000001418; Part number Norautron: 26107108; Part number NEMS: 100100093; Note: Chip Res 1%; Pad Count: 2; Component Status: Active; Part Number: R0201-1M0; Manufacturer Part Number: N.A.; ComponentLink1URL: N.A.; ComponentLink1Description: Datasheet; ComponentLink2URL: N.A.; ComponentLink2Description: Supplier link; HelpURL: N.A.; Footprint Doc: 0201; LatestRevisionDate: 2014-11-13; Published: 2014-11-13; Value: 1M0; Supplier 1: N.A.; Supplier Part Number 1: N.A.; Supplier 2: N.A.; Supplier Part Number 2: N.A.; Artikkelnr Noca: N.A.; PartId: 100100093; Component Class: Resistors; Author: rsk
R9 = R0201-N.C.: Not mounted; Manufacturer: N.A.; Part number NEMS: 100100107; Note: Chip Res; Assembly: Not mounted; Pad Count: 2; Component Status: Active; Part Number: R0201-N.C.; Manufacturer Part Number: N.A.; ComponentLink1URL: N.A.; ComponentLink1Description: Datasheet; ComponentLink2URL: N.A.; ComponentLink2Description: Supplier link; HelpURL: N.A.; Footprint Doc: 0201; LatestRevisionDate: 2014-11-13; Published: 2014-11-13; Value: N.C.; Supplier 1: N.A.; Supplier Part Number 1: N.A.; Supplier 2: N.A.; Supplier Part Number 2: N.A.; Artikkelnr Noca: N.A.; Part number IPS: N.A.; PartId: 100100107; Component Class: Resistors; Author: rsk; Part number Norautron: N.A.
R10 = R0201-100k: Resistor, ±1%, 0.05W; Manufacturer: N.A.; Part number IPS: 00000001419; Part number Norautron: 26108487; Part number NEMS: 100100080; Note: Chip Res 1%; Pad Count: 2; Component Status: Active; Part Number: R0201-100k; Manufacturer Part Number: N.A.; ComponentLink1URL: N.A.; ComponentLink1Description: Datasheet; ComponentLink2URL: N.A.; ComponentLink2Description: Supplier link; HelpURL: N.A.; Footprint Doc: 0201; LatestRevisionDate: 2014-11-13; Published: 2014-11-13; Value: 100k; Supplier 1: N.A.; Supplier Part Number 1: N.A.; Supplier 2: N.A.; Supplier Part Number 2: N.A.; Artikkelnr Noca: N.A.; PartId: 100100080; Component Class: Resistors; Author: rsk
SB3-SB10 = Solderbridge Shorted: Shorted Solderbridge; Manufacturer: N.A.; Part number NEMS: 100500459; Pad Count: 2; Component Status: Active; System: Connector; Part Number: Solderbridge Shorted; Manufacturer Part Number: N.A.; Footprint Doc: Solderbridge_Shorted; LatestRevisionDate: 2012-08-07; Published: 2012-08-07; Value: Solderbridge; Note: N.A.; Artikkelnr Noca: N.A.; Part number IPS: N.A.; ComponentLink1URL: N.A.; ComponentLink1Description: Datasheet; ComponentLink2URL: N.A.; ComponentLink2Description: Supplier link; HelpURL: N.A.; Supplier 1: N.A.; Supplier Part Number 1: N.A.; Supplier 2: N.A.; Supplier Part Number 2: N.A.; PartId: 100500459; Component Class: Connectors; Author: rsk; Part number Norautron: N.A.
SB11 = Solderbridge: Manufacturer: N.A.; Part number NEMS: 100500458; Pad Count: 2; Component Status: Active; System: Connector; Part Number: Solderbridge; Manufacturer Part Number: N.A.; LatestRevisionDate: 2009-12-14; Published: 2009-12-14; Value: Solderbridge; Note: N.A.; Artikkelnr Noca: N.A.; Footprint Doc: Solderbridge; Part number IPS: N.A.; ComponentLink1URL: N.A.; ComponentLink1Description: Datasheet; ComponentLink2URL: N.A.; ComponentLink2Description: Supplier link; HelpURL: N.A.; Supplier 1: N.A.; Supplier Part Number 1: N.A.; Supplier 2: N.A.; Supplier Part Number 2: N.A.; PartId: 100500458; Component Class: Connectors; Author: rsk; Part number Norautron: N.A.
TP1 TP2 = TP_SMD_Ø1.0MM: 1.0mm circular SMD testpad; Manufacturer: Nordic Semiconductor; Manufacturer Part Number: N.A.; Part number NEMS: 100500475; Pad Count: 1; Component Status: Active; Part Number: TP_SMD_Ø1.0MM; ComponentLink1URL: N.A.; ComponentLink1Description: Datasheet; ComponentLink2URL: N.A.; ComponentLink2Description: Supplier link; HelpURL: N.A.; Footprint Doc: TP_SMD_Ø1.0mm; LatestRevisionDate: 2021-03-05; Published: 2013-06-11; Value: Ø1.0mm,SMD; Note: N.A.; Artikkelnr Noca: N.A.; Part number IPS: N.A.; Supplier 1: N.A.; Supplier Part Number 1: N.A.; Supplier 2: N.A.; Supplier Part Number 2: N.A.; PartId: 100500475; Component Class: Connectors; Author: rsk; Part number Norautron: N.A.